# Altium schematic sheet power_stage.SchDoc
size A4; Author: Omri Nissan; Organization: Altium Limited; Address1: -; Address2: San Luis Obispo; Address3: California, 93401; Address4: United States; DocumentNumber: 4; SheetNumber: 4; SheetTotal: 8
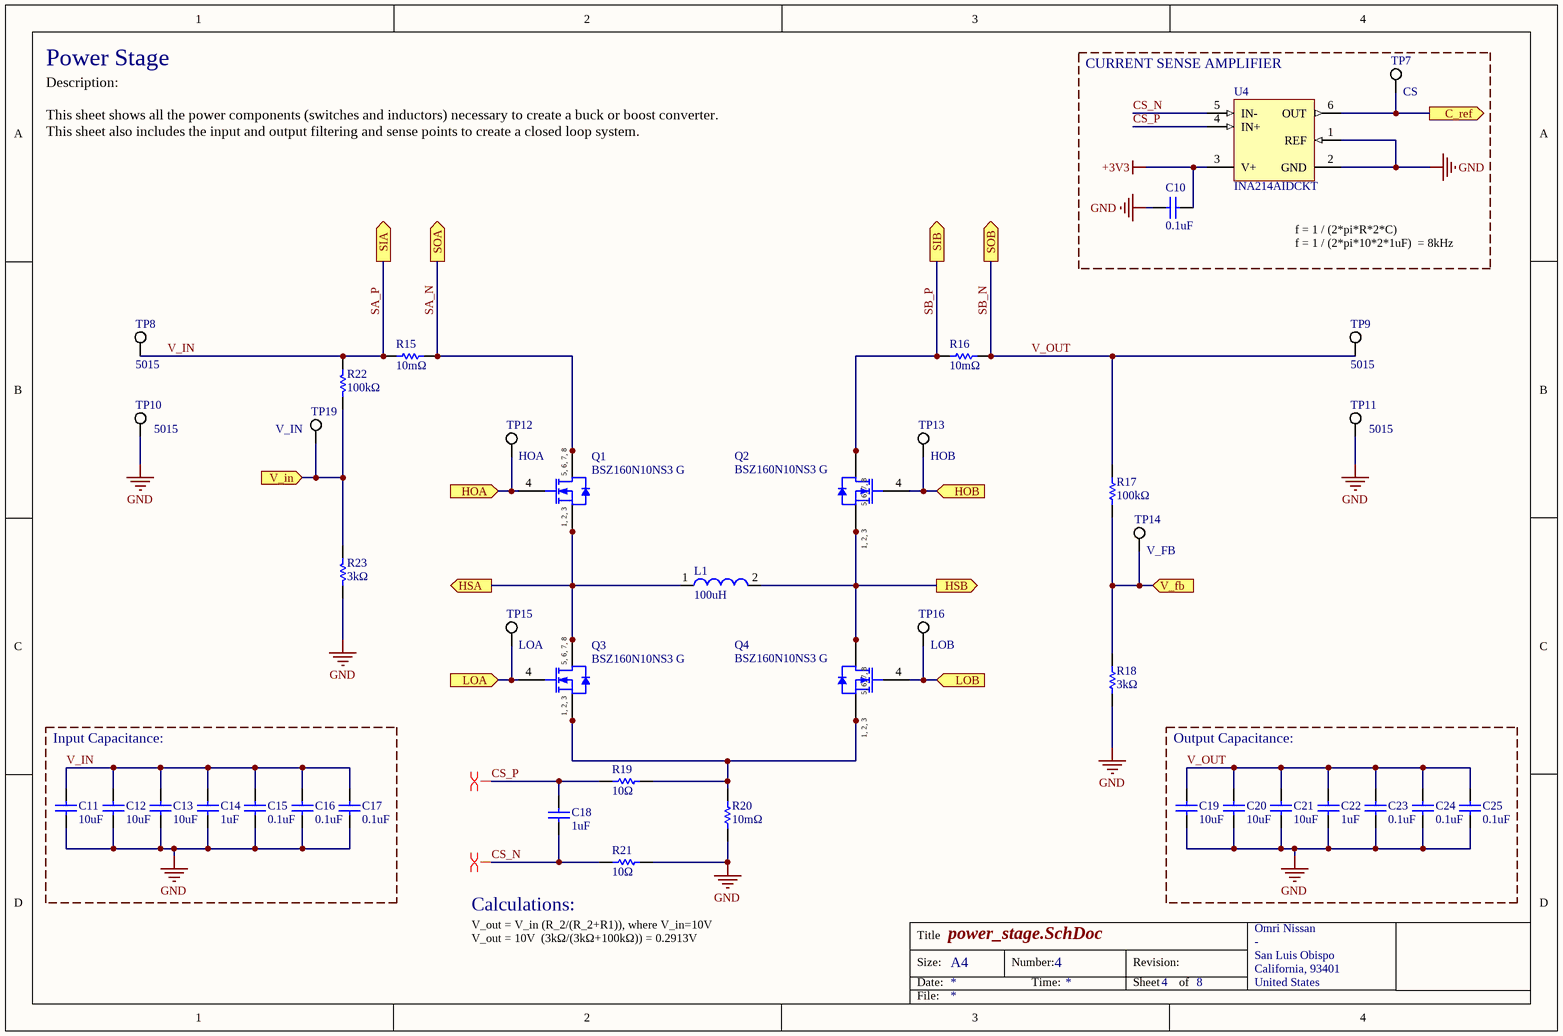
[diagram p0: power_stage.SchDoc]

## Parts
C10  0.1uF  [CAPC1608X90X35ML10T15]
C11  10uF  [CAPC3216X180X20LL20]
C12  10uF  [CAPC3216X180X20LL20]
C13  10uF  [CAPC3216X180X20LL20]
C14  1uF  [CAPC1608X90X20LL10]
C15  0.1uF  [CAPC1608X90X35ML10T15]
C16  0.1uF  [CAPC1608X90X35ML10T15]
C17  0.1uF  [CAPC1608X90X35ML10T15]
C18  1uF  [CAPC1608X90X20LL10]
C19  10uF  [CAPC3216X180X20LL20]
C20  10uF  [CAPC3216X180X20LL20]
C21  10uF  [CAPC3216X180X20LL20]
C22  1uF  [CAPC1608X90X20LL10]
C23  0.1uF  [CAPC1608X90X35ML10T15]
C24  0.1uF  [CAPC1608X90X35ML10T15]
C25  0.1uF  [CAPC1608X90X35ML10T15]
L1  100uH  [WE-PD-XXL]
Q1  BSZ160N10NS3 G  [INF-PG-TSDSON-8-1_V]
Q2  BSZ160N10NS3 G  [INF-PG-TSDSON-8-1_V]
Q3  BSZ160N10NS3 G  [INF-PG-TSDSON-8-1_V]
Q4  BSZ160N10NS3 G  [INF-PG-TSDSON-8-1_V]
R15  10mΩ  [RESC3216X70X50NL05T20]
R16  10mΩ  [RESC3216X70X50NL05T20]
R17  100kΩ  [RESC1608X55X30ML20T20]
R18  3kΩ  [RESC1608X55X25ML10T15]
R19  10Ω  [RESC1609X50X30NL10T20]
R20  10mΩ  [RESC3216X70X50NL05T20]
R21  10Ω  [RESC1609X50X30NL10T20]
R22  100kΩ  [RESC1608X55X30ML20T20]
R23  3kΩ  [RESC1608X55X25ML10T15]
TP7  CS  [KSTN-5012_V]
TP8  5015  [KSTN-5015_V]
TP9  5015  [KSTN-5015_V]
TP10  5015  [KSTN-5015_V]
TP11  5015  [KSTN-5015_V]
TP12  HOA  [KSTN-5012_V]
TP13  HOB  [KSTN-5012_V]
TP14  V_FB  [KSTN-5012_V]
TP15  LOA  [KSTN-5012_V]
TP16  LOB  [KSTN-5012_V]
TP19  V_IN  [KSTN-5012_V]
U4  INA214AIDCKT  [DCK0006A_L]

## Blocks framed on the sheet
CURRENT SENSE AMPLIFIER: C10 TP7 U4
Input Capacitance:: C11-C17
Output Capacitance:: C19-C25

## Ports
C_ref (out), HOA (in), HOB (in), HSA (out), HSB (out), LOA (in), LOB (in), SIA (out), SIB (out), SOA (out), SOB (out), V_fb (in), V_in (in)

## Nets
+3V3: C10.1 U4.3(V+)
GND: C10.2 C11.1 C12.1 C13.1 C14.2 C15.1 C16.1 C17.1 C19.1 C20.1 C21.1 C22.2 C23.1 C24.1 C25.1 R18.1 R20.1 R21.2 R23.1 TP10.1 TP11.1 U4.1(REF) U4.2(GND)
C_ref: TP7.1 U4.6(OUT) ; port C_ref
CS_N: C18.2 R21.1 U4.5(IN-)
CS_P: C18.1 R19.1 U4.4(IN+)
HOA: Q1.4(GATE) TP12.1 ; port HOA
HOB: Q2.4(GATE) TP13.1 ; port HOB
HSA: L1.1 Q1.1(SOURCE) Q1.2(SOURCE) Q1.3(SOURCE) Q3.5(DRAIN) Q3.6(DRAIN) Q3.7(DRAIN) Q3.8(DRAIN) ; port HSA
HSB: L1.2 Q2.1(SOURCE) Q2.2(SOURCE) Q2.3(SOURCE) Q4.5(DRAIN) Q4.6(DRAIN) Q4.7(DRAIN) Q4.8(DRAIN) ; port HSB
LOA: Q3.4(GATE) TP15.1 ; port LOA
LOB: Q4.4(GATE) TP16.1 ; port LOB
SA_N: Q1.5(DRAIN) Q1.6(DRAIN) Q1.7(DRAIN) Q1.8(DRAIN) R15.2 ; port SOA
SA_P: C11.2 C12.2 C13.2 C14.1 C15.2 C16.2 C17.2 R15.1 R22.2 TP8.1 ; port SIA  [also labelled V_IN]
SB_N: C19.2 C20.2 C21.2 C22.1 C23.2 C24.2 C25.2 R16.2 R17.2 TP9.1 ; port SOB  [also labelled V_OUT]
SB_P: Q2.5(DRAIN) Q2.6(DRAIN) Q2.7(DRAIN) Q2.8(DRAIN) R16.1 ; port SIB
V_fb: R17.1 R18.2 TP14.1 ; port V_fb
V_in: R22.1 R23.2 TP19.1 ; port V_in
NetQ3_1: Q3.1(SOURCE) Q3.2(SOURCE) Q3.3(SOURCE) Q4.1(SOURCE) Q4.2(SOURCE) Q4.3(SOURCE) R19.2 R20.2

## Layout directives
differential pair: CS_N, CS_P

## Notes on the sheet
- Power Stage
- Description:
  This sheet shows all the power components (switches and inductors) necessary to create a buck or boost converter. This sheet also includes the input and output filtering and sense points to create a closed loop system.
- f = 1 / (2*pi*R*2*C)
  f = 1 / (2*pi*10*2*1uF)  = 8kHz
- (near R21) Calculations:
- V_out = V_in (R_2/(R_2+R1)), where V_in=10V
  V_out = 10V  (3kΩ/(3kΩ+100kΩ)) = 0.2913V
- Title
- Size:
- Date:
- A4
- Number:
- Time:
- Revision:
- Sheet
- of
- File:
- (in symbol CMP-1091-00308-1) 5, 6, 7, 8; 1, 2, 3

## Library data of the parts
C10 C15-C17 C23-C25 = CMP-2100-03643-1: GRM188R71H104KA93D - Chip Capacitor, 0.1 uF, +/- 10%, 50 V, -55 to 125 degC, 0603 (1608 Metric), RoHS, Tape and Reel; Manufacturer: Murata; Dielectric Material: Ceramic; Voltage Rating: 50V; Capacitance: 100nF; Dielectric: X7R; Insulation Resistance: 10GR; Case Code (Metric): 1608; Lead Free: LeadFree; Depth: 0.8mm; Number of Pins: 2; Radiation Hardening: No; Case/Package: 0603; Manufacturer URL: http://www.murata.com/; Packaging: TapeandReel; Length: 1.6mm; Contact Plating: Tin; Datasheet URL: http://psearch.en.murata.com/capacitor/product/GRM188R71H104KA93%23.pdf; Tolerance: 10%; Case Code (Imperial): 0603; Min Operating Temperature: -55degC; RoHSCompliant: true; Voltage: 50V; Termination: SMD/SMT; Mount: SurfaceMount; Material: Ceramic; Package Quantity: 1; Height: 0.8mm; Thickness: 0.035inch; REACH SVHC: NoSVHC; Max Operating Temperature: 125degC; Width: 0.8mm; Package Reference: 0603; Voltage Rating (DC): 50V; Datasheet Version: 42675.0; Package Description: 2-Pin Surface Mount Device, Body 1.6 x 0.8 mm
C11-C13 C19-C21 = CMP-2000-06045-1: C3216X5R1H106K160AB - Chip Capacitor, 10 uF, +/- 10%, 50 V, -55 to 85 degC, 1206 (3216 Metric), RoHS, Tape and Reel; Manufacturer: TDK; PCN Part Number: MLCCPartNumberChange30/Nov/2012; Temperature Coefficient: X5R; Catalog Drawings: CSERIES_1206_1.8; Capacitance: 10µF; Product Training Modules: CSeriesGeneralApplicationsSEAT,CCV,andTVCLDesignToolsGuidetoReplacinganElectrolyticCapacitorwithanMLCC; Voltage - Rated: 50V; Other Names: 445-5998-6; Online Catalog: CSeries,GeneralPurpose; Family: CeramicCapacitors; Package URL: https://product.tdk.com/info/en/documents/chara_sheet/C3216X7R1V106K160AC.pdf; Height - Seated (Max): -; RoHS Information: RoHSCertificate-MLCC; Ratings: -; Series: C; Applications: GeneralPurpose; Thickness (Max): 0.071"(1.80mm); Manufacturer URL: http://www.tdk.com/; Standard Package: 1; Operating Temperature: -55°C~85°C; Tolerance: ±10%; Datasheet URL: https://product.tdk.com/info/en/catalog/datasheets/mlcc_commercial_general_en.pdf; Package / Case: 1206(3216Metric); Package Description: 2-Pin Surface Mount Device, Body 3.2 x 1.6 mm; Size / Dimension: 0.126"Lx0.063"W(3.20mmx1.60mm); Mounting Technology: SurfaceMount; Packaging: Digi-Reel®; Category: Capacitors; Package Reference: 1206; Mounting Type: SurfaceMount,MLCC; Datasheet Version: 08/2016; Lead Style: -; Features: -; Lead Spacing: -
C14 C18 C22 = CMP-2000-06025-1: C1608X5R1H105K080AB- Chip Capacitor, 1 uF, +/- 10%, 50 V, -55 to 85 degC, 0603 (1608 Metric), RoHS, Tape and Reel; Manufacturer: TDK; PCN Part Number: MLCCPartNumberChange30/Nov/2012; Other Names: 445-7468-6; Online Catalog: CSeries,GeneralPurpose; Capacitance: 1µF; Product Training Modules: CSeriesGeneralApplicationsSEAT,CCV,andTVCLDesignToolsGuidetoReplacinganElectrolyticCapacitorwithanMLCC; Voltage - Rated: 50V; Design Resources: 20WNon-IsolatedBuckLEDDriverUsingPLLNK460KG; Temperature Coefficient: X5R; Series: C; Datasheet Version: 08/2016; Package Description: 2-Pin Surface Mount Device, Body 1.6 x 0.8 mm; Mounting Technology: SurfaceMount; Features: -; Size / Dimension: 0.063"Lx0.031"W(1.60mmx0.80mm); Lead Spacing: -; Operating Temperature: -55°C~85°C; Tolerance: ±10%; Height - Seated (Max): -; Mounting Type: SurfaceMount,MLCC; Ratings: -; Standard Package: 1; Applications: GeneralPurpose; Datasheet URL: https://product.tdk.com/info/en/catalog/datasheets/mlcc_commercial_general_en.pdf; Category: Capacitors; Lead Style: -; Packaging: Digi-Reel®; RoHS Information: RoHSCertificate-MLCC; Package / Case: 0603(1608Metric); Package Reference: 0603; Manufacturer URL: http://www.tdk.com/; Thickness (Max): 0.035"(0.90mm); Family: CeramicCapacitors
L1 = CMP-0227-00035-1: 7447709101 - SMD-Shielded Power Inductor WE-PD, L = 100 µH; Inductance: 100 ÂµH; ComponentLink2Description: Datasheet; DatasheetVersion: ver 1, Oct-2004; PackageDescription: SMD Inductor, 2-Leads, Body 12.0 x 12.0 mm; ComponentLink1URL: http://www.we-online.com; PackageVersion: 2004; PackageReference: WE-PD-XXL; ComponentLink2URL: http://www.we-online.de/katalog/media/pdf/7447709101.pdf; ComponentLink1Description: Manufacturer Link
Q1-Q4 = CMP-1091-00308-1: N-Channel OptiMOS 3 Power-Transistor, 100 V VDS, 40 A ID, -55 to 150 degC, PG-TSDSON-8-1, Reel, Green; Manufacturer: Infineon; VGS(th) (min): 2Â V; VDS (max): 100Â V; IDpuls (max): 160Â A; Ptot (max): 63Â W; RthJC (max): 2.1Â K/W; RthJA (max): 62 K/W; ID (max): 40Â A; RDS (on) (max): 16Â mOhm; VGS(th) (max): 3.5Â V; QG: 19Â nC; Green: TRUE; Polarity: N; Halogen-free: TRUE; ComponentLink3URL: http://www.infineon.com/dgdl/BSZ240N12NS3+Rev2.0.pdf?folderId=db3a304313b8b5a60113cee8763b02d7&fileId=db3a30432a40a650012a42f3057a0038; PackageReference: PG-TSDSON-8-1; PartNumber: BSZ160N10NS3 G; Packing: Reel; Mounting Technology: Surface Mount; Rth: 2.1Â K/W; PackageVersion: Rev. 02, 09/2008; DatasheetVersion: Rev. 1.2; ComponentLink3Description: Package Specification; ComponentLink2URL: http://www.infineon.com/dgdl/BSZ160N10N3SG_rev1.2.pdf?folderId=db3a304313b8b5a60113cee8763b02d7&fileId=db3a304320896aa20120c3365eef2370; ComponentLink1Description: Manufacturer URL; ComponentLink2Description: Datasheet; ComponentLink1URL: http://www.infineon.com/; PackageDescription: 8-Pin Plastic (Green) Thin Dual Small Outline Non-Leaded Package, 3.3 x 3.3 mm Body, 0.65 mm Pitch
R15 R16 R20 = CMP-2003-00786-1: ERJ8CWFR010V; Manufacturer: Panasonic; Part Number: ERJ8CWFR010V
R17 R22 = CMP-2000-00875-1: ERA3AEB104V; Manufacturer: Panasonic; Part Number: ERA3AEB104V
R18 R23 = CMP-2000-04454-1: RT0603BRD073KL; Manufacturer: Yageo; Part Number: RT0603BRD073KL
R19 R21 = CMP-2000-03849-1: CRCW060310R0JNEA; Manufacturer: Vishay Dale; Part Number: CRCW060310R0JNEA
TP7 TP12-TP16 TP19 = CMP-1672-00004-4: Test Point, White, Through Hole, RoHS, Bulk; Manufacturer: Keystone; DatasheetVersion: Rev. F, 12/2013; ComponentLink1URL: http://www.keyelco.com/; PackageReference: 5012; RoHSCompliant: true; ComponentLink2Description: Datasheet; Colour: White; Contact Material: Bronze; PackageDescription: 1-Pin Through Hole Device, Dia 3.17 mm; Mounting Technology: Through Hole; Mount: Through Hole; Package Quantity: 100; ComponentLink1Description: Manufacturer URL; Pins: 1; Height: 8.12 mm; Packaging: Bulk; REACH SVHC: No SVHC; Contact Plating: Silver; Length: 11.3 mm; ComponentLink2URL: http://www.keyelco.com/product-pdf.cfm?p=1321
TP8-TP11 = CMP-2000-05183-1: Test Point, White, SMT; Manufacturer: Keystone; Primary Type: PCBTestPoints; Style: Miniature; Finish Plating: SilverPlate; Material, Contact: PhosphorBronze; Material: PhosphorBronze; Datasheet URL: https://datasheet.ciiva.com/1123/5015-1123862.pdf; Thickness: 0.010In.; Manufacturer URL: http://www.keyelco.com/; Length: 0.105"(2.667mm); Datasheet Version: Mar-14; Contact Plating: Silver; Mounting Type: SurfaceMount; Termination: SMT; Type: TestPointsonTapeandReel; Height: 0.06In.; Mounting: SurfaceMount
U4 = CMP-2000-06456-1: Voltage Output, High / Low-Side Measurement, Bi-Directional Zero-Drift Series, Current Shunt Monitor, 2.7 to 26 V, -40 to 125 degC, 6-Pin SOT-23 (DCK6), Green (RoHS & no Sb/Br), Tape and Reel; Package Version: 4093553-4/G, 01/2007; Development Kit: INA210-214EVM; Unit Weight: 0.000088oz; Vcm - Common Mode Voltage: -0.3Vto+26V; Gain V/V: 100V/V; Operating Supply Current: 115uA; Topology: CurrentShuntFeedback; Number of Channels: 1Channel; Accuracy: 1%; Amplifier Type: CurrentSense; Gain Error: 0.02%; Vos - Input Offset Voltage: 60uV; Brand: TexasInstruments; Supply Voltage - Max: 26V; CMRR - Common Mode Rejection Ratio: 105dB; Supply Voltage - Min: 2.7V; GBP - Gain Bandwidth Product: 30kHz; Product Category: CurrentSenseAmplifiers; Series: INA214; Mounting Style: SMD/SMT; Datasheet URL: http://www.ti.com/lit/gpn/INA214?keyMatch=INA214AIDCKT&tisearch=Search-EN-Everything; Maximum Operating Temperature: +125C; Package / Case: SOT-23-6; Minimum Operating Temperature: -40C; Datasheet Version: Rev. G, 07/2014; RoHS: True; Manufacturer URL: http://www.ti.com/; Package Description: 6-Pin Plastic Small Outline, Body 2 x 1.25 mm, Pitch 0.65 mm; Product: CurrentSenseAmplifiers; Package Reference: DCK6; Packaging: Reel; Manufacturer: TexasInstruments; Mounting Technology: SurfaceMount